# Altium schematic sheet TF.SchDoc
size A4; SheetNumber: 8; SheetTotal: 17
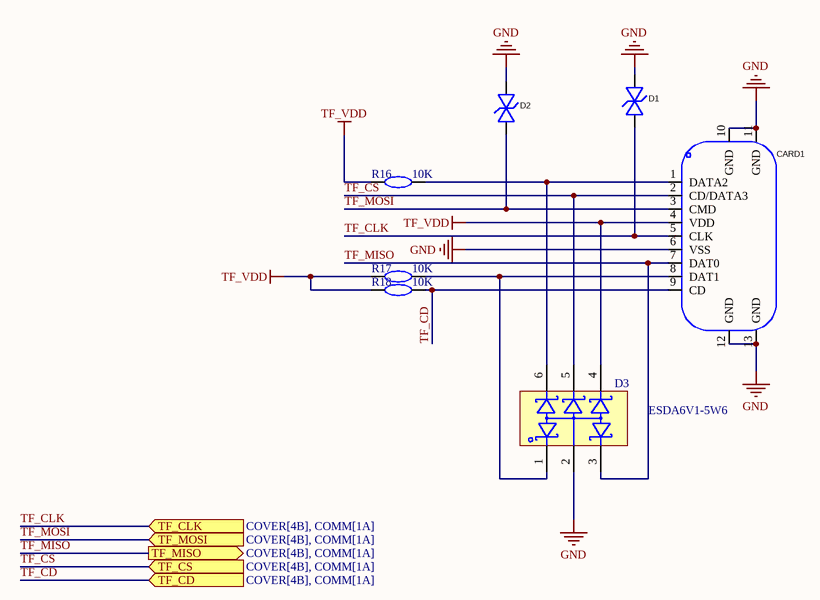
[diagram p0: TF.SchDoc]

## Parts
CARD1  TF-115-BCP9  [TF-SMD_TF-115-BCP9]  (value not drawn)
D1  DESD3V3S1BL-7B  [X1-DFN1006-2_L1.0-W0.6-BI]  (value not drawn)
D2  DESD3V3S1BL-7B  [X1-DFN1006-2_L1.0-W0.6-BI]  (value not drawn)
D3  ESDA6V1-5W6  [SOT323-6L_L2.0-W1.3-LS2.1-BR]
R16  10K  [R0402]
R17  10K  [R0402]
R18  10K  [R0402]

## Ports
TF_CD (in, see COVER[4B], COMM[1A]), TF_CLK (in, see COVER[4B], COMM[1A]), TF_CS (in, see COVER[4B], COMM[1A]), TF_MISO (out, see COVER[4B], COMM[1A]), TF_MOSI (in, see COVER[4B], COMM[1A])

## Nets
GND: CARD1.6(VSS) CARD1.10(GND) CARD1.11(GND) CARD1.12(GND) CARD1.13(GND) D1.2 D2.2 D3.2
TF_VDD: CARD1.4(VDD) D3.4 R16.1 R17.1 R18.1
TF_CD: CARD1.9(CD) R18.2 ; port TF_CD
TF_CLK: CARD1.5(CLK) D1.1 ; port TF_CLK
TF_CS: CARD1.2(CD/DATA3) D3.5 ; port TF_CS
TF_MISO: CARD1.7(DAT0) D3.3 ; port TF_MISO
TF_MOSI: CARD1.3(CMD) D2.1 ; port TF_MOSI
NetCARD1_1: CARD1.1(DATA2) D3.6 R16.2
NetCARD1_8: CARD1.8(DAT1) D3.1 R17.2

## Library data of the parts
CARD1 = TF-115-BCP9: Manufacturer: XUNPU(讯普); Add into BOM: yes; Card Connection Mode: 自弹式; Card Type: MicroSD卡(TF卡); Connector Type: 卡座; Maximum Body Height: 1.8mm; Soldering Temperature(Max): 260℃; Symbol: TF-115-BCP9; Device: TF-115-BCP9; LCSC Part Name: 自弹式 MicroSD卡(TF卡) 卡座; Supplier Part: C720505; Manufacturer Part: TF-115-BCP9; Supplier Footprint: SMD; JLCPCB Part Class: Extended Part; Datasheet: https://atta.szlcsc.com/upload/public/pdf/source/20210906/DBEC8F03AA1503572333C7CF4A76D0AD.pdf; Supplier: LCSC; Convert to PCB: yes; Contact Material: 磷铜; Contact Plating: 锡; Operating Temperature Range: -25℃~+85℃
D1 D2 = DESD3V3S1BL-7B: Manufacturer: DIODES(美台); Add into BOM: yes; Reverse Stand-Off Voltage (Vrwm): 3.3V@Max; Maximum Clamping Voltage: 7V; Peak Pulse Current (Ipp)@10/1000us: 5A@8/20us; Peak Pulse Power Dissipation (Ppp)@10/1000us: 35W; Breakdown Voltage: 3.8V; Type: TVS; Symbol: DESD3V3S1BL-7B; Device: DESD3V3S1BL-7B; LCSC Part Name: DESD3V3S1BL-7B; Supplier Part: C500765; Manufacturer Part: DESD3V3S1BL-7B; Supplier Footprint: X1-DFN1006-2; JLCPCB Part Class: Extended Part; Datasheet: https://atta.szlcsc.com/upload/public/pdf/source/20200324/C500765_A188D09536B76D3DE18AC7040917D9B9.pdf; Supplier: LCSC; Convert to PCB: yes
D3 = ESDA6V1-5W6: C87908; Manufacturer: ST(意法半导体); Symbol: ESDA6V1-5W6_C87908; Add into BOM: yes; Name: ESDA6V1-5W6; Device: ESDA6V1-5W6; LCSC Part Name: ESDA6V1-5W6; Supplier Part: C87908; Manufacturer Part: ESDA6V1-5W6; Supplier Footprint: SOT-323-6L; JLCPCB Part Class: Extended Part; Datasheet: https://atta.szlcsc.com/upload/public/pdf/source/20181012/C87908_152F6E511283D805F586217F4267C685.pdf; Supplier: LCSC; Convert to PCB: yes
R16-R18 = Res_0402: Symbol: 电阻; Device: Res_0603; Convert to PCB: yes; Add into BOM: yes; Supplier Footprint: 0603; Value: 10K; Name: 10K